# EAGLE schematic dynalofet (EAGLE 9.4.2)
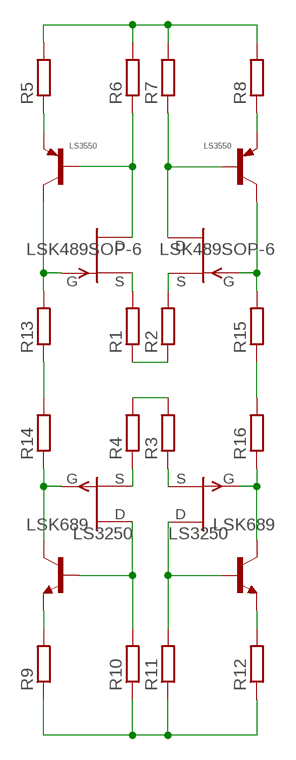
[diagram p0: schematic, sheet 1]

## Parts
Q1  LS3250  [SOT-23-6]
Q2  LS3550  [SOT-23-6]
Q3  LSK489SOP-6  [SOT-23-6]
Q4  LSK689  [SOT-23-6]
R1  R-EU_MELF0204W  [MINI_MELF-0204W]
R2  R-EU_MELF0204W  [MINI_MELF-0204W]
R3  R-EU_MELF0204W  [MINI_MELF-0204W]
R4  R-EU_MELF0204W  [MINI_MELF-0204W]
R5  R-EU_MELF0204W  [MINI_MELF-0204W]
R6  R-EU_MELF0204W  [MINI_MELF-0204W]
R7  R-EU_MELF0204W  [MINI_MELF-0204W]
R8  R-EU_MELF0204W  [MINI_MELF-0204W]
R9  R-EU_MELF0204W  [MINI_MELF-0204W]
R10  R-EU_MELF0204W  [MINI_MELF-0204W]
R11  R-EU_MELF0204W  [MINI_MELF-0204W]
R12  R-EU_MELF0204W  [MINI_MELF-0204W]
R13  R-EU_MELF0204W  [MINI_MELF-0204W]
R14  R-EU_MELF0204W  [MINI_MELF-0204W]
R15  R-EU_MELF0204W  [MINI_MELF-0204W]
R16  R-EU_MELF0204W  [MINI_MELF-0204W]

## Nets
N$1: Q2.3(B) Q3.5(D) R6.1
N$2: Q2.4(C) Q3.4(G) R13.2
N$3: Q2.1(B) Q3.2(D) R7.1
N$4: Q2.6(C) Q3.1(G) R15.2
N$5: Q1.4(C) Q4.4(G) R14.1
N$6: Q1.3(B) Q4.5(D) R10.2
N$7: Q1.1(B) Q4.2(D) R11.2
N$8: Q1.6(C) Q4.1(G) R16.1
N$9: Q4.3(S) R3.1
N$10: Q4.6(S) R4.1
N$11: Q3.6(S) R1.2
N$12: Q3.3(S) R2.2
N$13: R1.1 R2.1
N$14: R3.2 R4.2
N$15: R5.2 R6.2 R7.2 R8.2
N$16: Q2.5(E) R8.1
N$17: Q2.2(E) R5.1
N$18: Q1.2(E) R9.2
N$19: Q1.5(E) R12.2
N$20: R9.1 R10.1 R11.1 R12.1
N$21: R13.1 R14.2
N$22: R15.1 R16.2

## Library data of the parts
Q1 = Vwvwbg:LS3250
Q2 = Vwvwbg:LS3550
Q3 = Vwvwbg:LSK489
Q4 = Vwvwbg:LSK689
R1-R16 = Vwvwbg:R-EU_: RESISTOR, European symbol